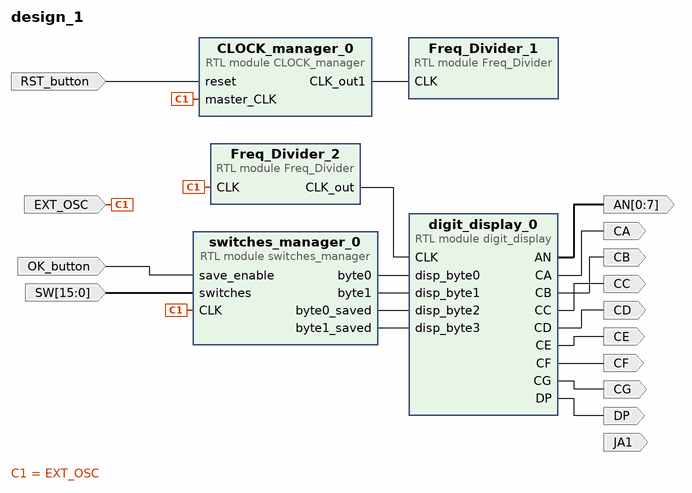
[diagram p0: block diagram of the top level]
# Vivado block design design_1, xc7a100tcsg324-1, Vivado 2017.4.1
create_bd_design design_1

create_bd_port -dir O JA1
create_bd_port -dir I -type clk EXT_OSC
set_property -dict {CONFIG.FREQ_HZ 100000000} [get_bd_ports EXT_OSC]
create_bd_port -dir I -type rst RST_button
create_bd_port -dir O CA
create_bd_port -dir O CB
create_bd_port -dir O CF
create_bd_port -dir O -from 0 -to 7 AN
create_bd_port -dir O CE
create_bd_port -dir O CD
create_bd_port -dir O CC
create_bd_port -dir O CG
create_bd_port -dir O DP
create_bd_port -dir I OK_button
create_bd_port -dir I -from 15 -to 0 SW

create_bd_cell -type module -reference Freq_Divider Freq_Divider_2
set_property -dict {CONFIG.divide_by 10000} [get_bd_cells Freq_Divider_2]
create_bd_cell -type module -reference Freq_Divider Freq_Divider_1
set_property -dict {CONFIG.divide_by 100000000} [get_bd_cells Freq_Divider_1]
create_bd_cell -type module -reference digit_display digit_display_0
create_bd_cell -type module -reference switches_manager switches_manager_0
create_bd_cell -type module -reference CLOCK_manager CLOCK_manager_0
set_property -dict {CONFIG.multiplier 16 CONFIG.Divide_0 15 CONFIG.Divide_1 16} [get_bd_cells CLOCK_manager_0]

# ---- connections ----

connect_bd_net [get_bd_ports EXT_OSC] [get_bd_pins Freq_Divider_2/CLK] [get_bd_pins switches_manager_0/CLK] [get_bd_pins CLOCK_manager_0/master_CLK]
# net CLOCK_manager_0_CLKFBOUT has one end: 
connect_bd_net [get_bd_pins CLOCK_manager_0/CLK_out1] [get_bd_pins Freq_Divider_1/CLK]
connect_bd_net [get_bd_ports RST_button] [get_bd_pins CLOCK_manager_0/reset]
connect_bd_net [get_bd_pins Freq_Divider_2/CLK_out] [get_bd_pins digit_display_0/CLK]
connect_bd_net [get_bd_pins digit_display_0/CA] [get_bd_ports CA]
connect_bd_net [get_bd_pins digit_display_0/CB] [get_bd_ports CB]
connect_bd_net [get_bd_pins digit_display_0/CF] [get_bd_ports CF]
connect_bd_net [get_bd_pins digit_display_0/AN] [get_bd_ports AN]
connect_bd_net [get_bd_pins digit_display_0/CE] [get_bd_ports CE]
connect_bd_net [get_bd_pins digit_display_0/CD] [get_bd_ports CD]
connect_bd_net [get_bd_pins digit_display_0/CC] [get_bd_ports CC]
connect_bd_net [get_bd_pins digit_display_0/CG] [get_bd_ports CG]
connect_bd_net [get_bd_pins digit_display_0/DP] [get_bd_ports DP]
connect_bd_net [get_bd_ports OK_button] [get_bd_pins switches_manager_0/save_enable]
connect_bd_net [get_bd_ports SW] [get_bd_pins switches_manager_0/switches]
connect_bd_net [get_bd_pins switches_manager_0/byte0] [get_bd_pins digit_display_0/disp_byte0]
connect_bd_net [get_bd_pins switches_manager_0/byte1] [get_bd_pins digit_display_0/disp_byte1]
connect_bd_net [get_bd_pins switches_manager_0/byte0_saved] [get_bd_pins digit_display_0/disp_byte2]
connect_bd_net [get_bd_pins switches_manager_0/byte1_saved] [get_bd_pins digit_display_0/disp_byte3]

validate_bd_design
save_bd_design
